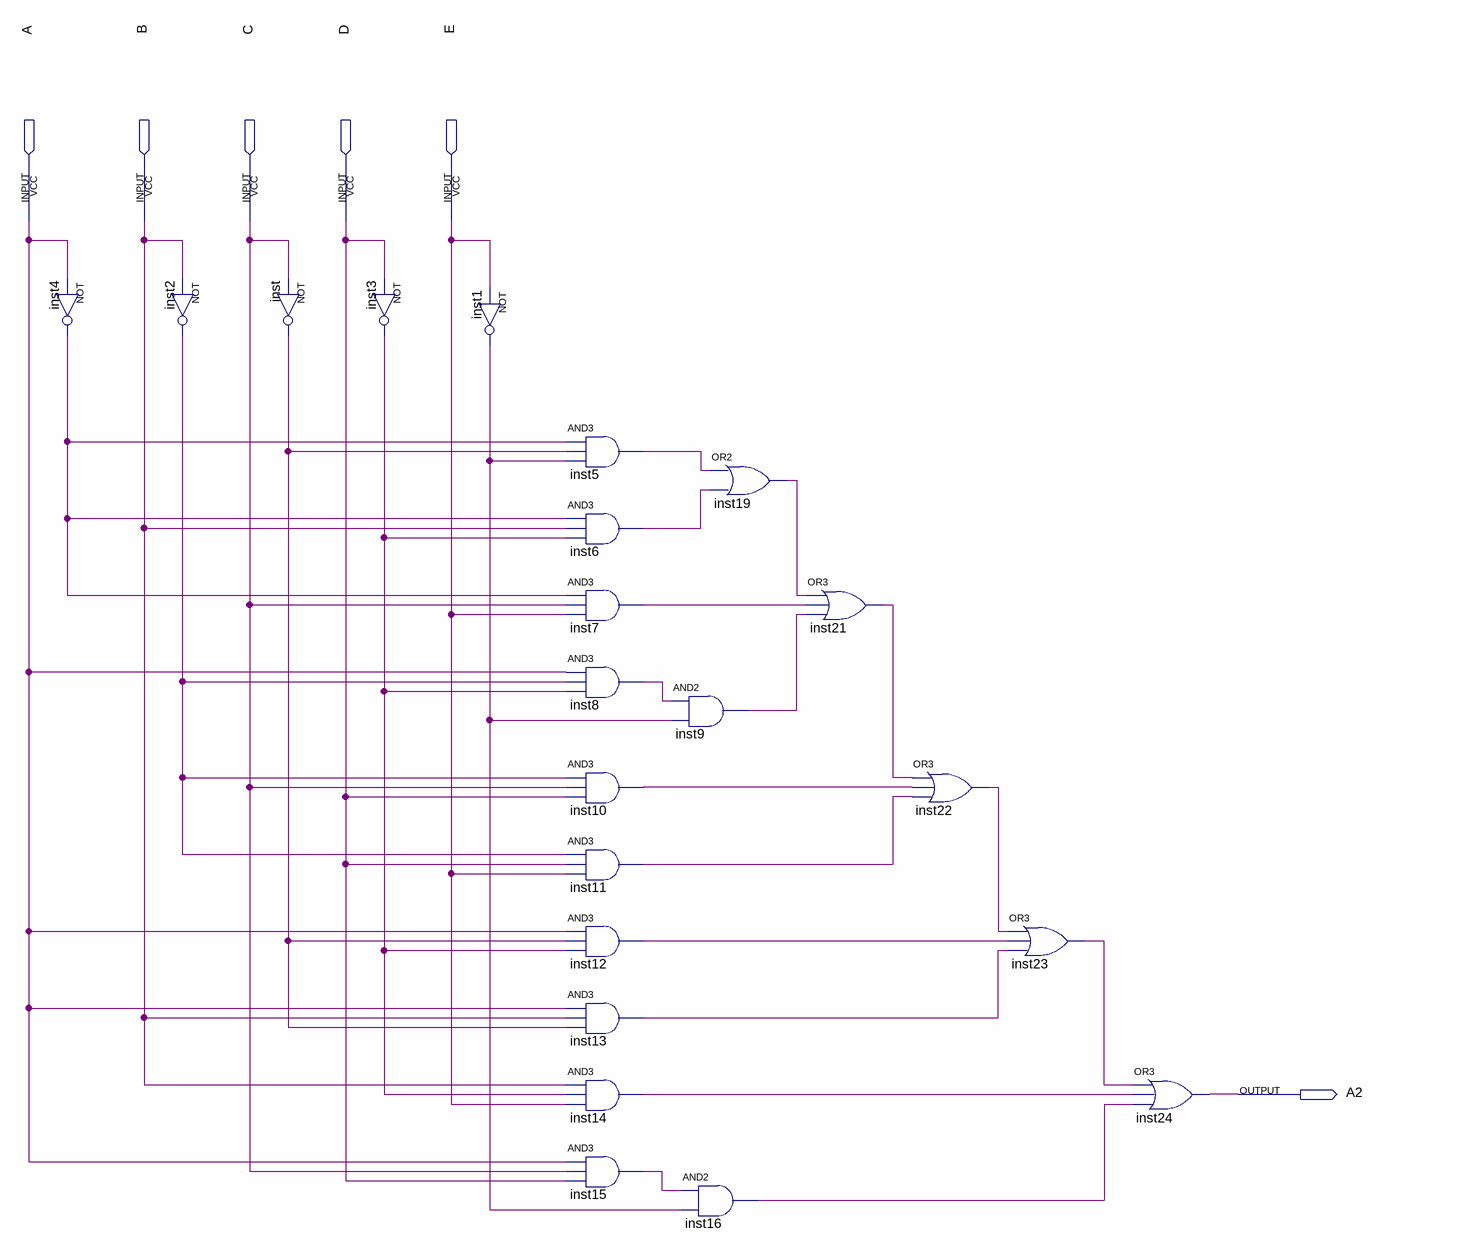
[diagram p0: schematic sheet]
// Quartus schematic led-A2.bdf as structural Verilog: 22 symbols, 6 pins
module \led-A2  (
  input  A,
  input  B,
  input  C,
  input  D,
  input  E,
  output A2
);

  wire inst1_out, inst2_out, inst3_out, inst4_out, inst5_out, inst6_out, inst7_out, inst8_out, inst9_out,
       inst10_out, inst11_out, inst12_out, inst13_out, inst14_out, inst15_out, inst16_out, inst19_out,
       inst21_out, inst22_out, inst23_out, inst_out;

  not inst4 (inst4_out, A);
  not inst2 (inst2_out, B);
  not inst (inst_out, C);
  not inst3 (inst3_out, D);
  not inst1 (inst1_out, E);
  and inst5 (inst5_out, inst4_out, inst_out, inst1_out);
  and inst6 (inst6_out, inst4_out, B, inst3_out);
  and inst7 (inst7_out, inst4_out, C, E);
  and inst8 (inst8_out, A, inst2_out, inst3_out);
  and inst10 (inst10_out, inst2_out, C, D);
  and inst11 (inst11_out, inst2_out, D, E);
  and inst12 (inst12_out, A, inst_out, inst3_out);
  and inst13 (inst13_out, A, B, inst_out);
  and inst14 (inst14_out, B, inst3_out, E);
  and inst15 (inst15_out, A, C, D);
  and inst9 (inst9_out, inst8_out, inst1_out);
  and inst16 (inst16_out, inst15_out, inst1_out);
  or inst19 (inst19_out, inst5_out, inst6_out);
  or inst21 (inst21_out, inst19_out, inst7_out, inst9_out);
  or inst22 (inst22_out, inst21_out, inst10_out, inst11_out);
  or inst23 (inst23_out, inst22_out, inst12_out, inst13_out);
  or inst24 (A2, inst23_out, inst14_out, inst16_out);
endmodule
